# EAGLE design GW-RS485-V41-007 (EAGLE 9.1.0)
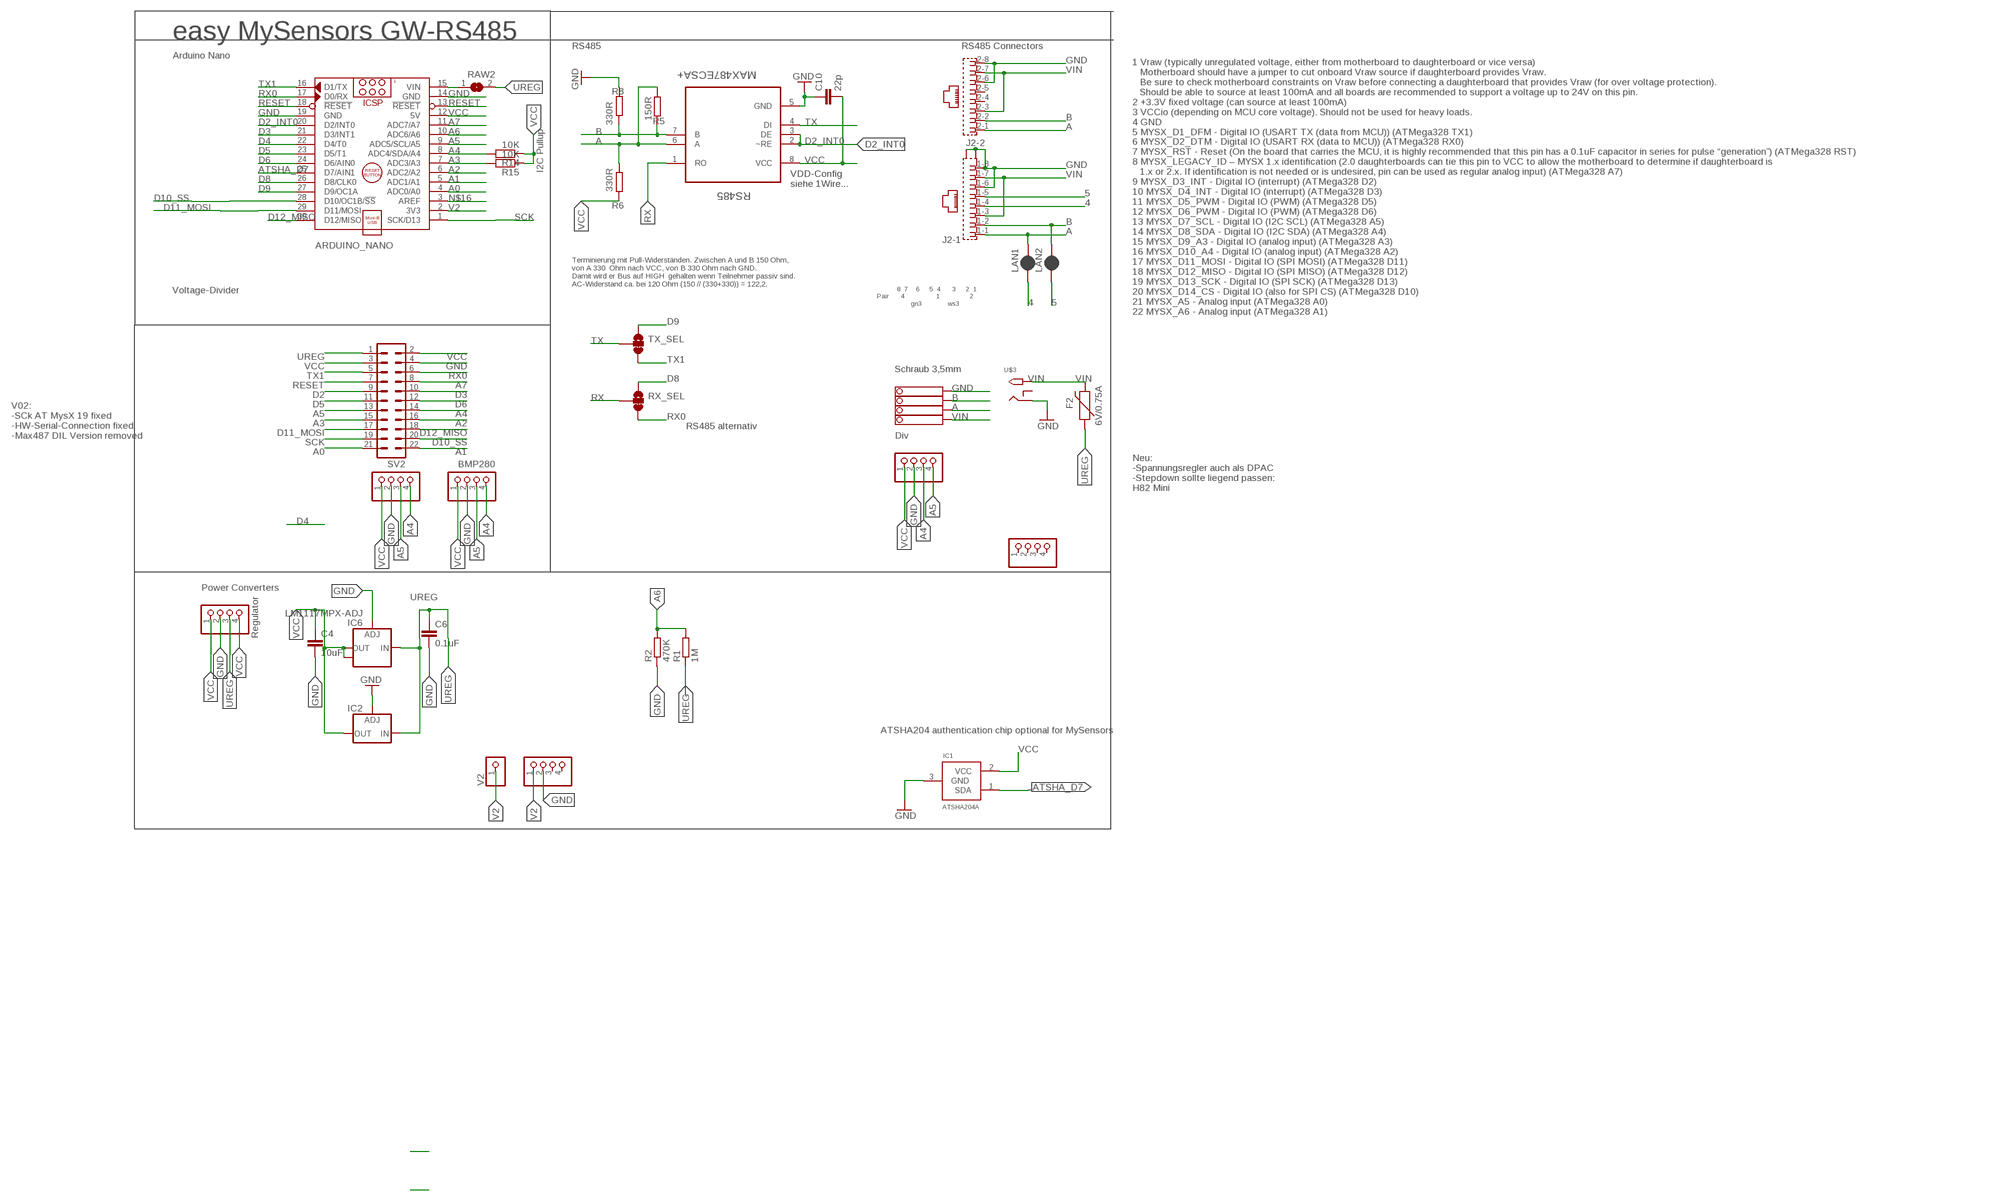
[diagram p0: schematic, sheet 1]

## Parts
ARDUINO_NANO  ARDUINO_NANO_OHNE-BOHR  [ARDUINO_NANO]
BH1750  PINHD-1X04_2.54-S  [1X04-S]
C4  10uF  C-EUC1210  [C1210]
C6  0.1uF  C-EUC1206  [C1206]
C10  22p  C-EUC0805  [C0805]
F2  6V/0.75A  PPTC_THREE-QUARTER-AMP  [1206]
I2C-1  PINHD-1X04_2.54-S  [1X04-S]
I2C-2  PINHD-1X04_2.54-S  [1X04-S]
IC1  ATSHA204A  [SOT23]
IC2  LD117ADT50TR  [DPACK]
IC6  LM1117MPX-ADJ  [SOT223]
J2  RJ45_2X_S  [RJ45_2X_S]
JP2  PINHD-1X04_2.54-S  [1X04-S]
LAN1  JUMPER-SMT_2_NC_PASTE_SILK  [SMT-JUMPER_2_NC_PASTE_SILK]
LAN2  JUMPER-SMT_2_NC_PASTE_SILK  [SMT-JUMPER_2_NC_PASTE_SILK]
R1  1M  R-EU_R0805  [R0805]
R2  470K  R-EU_R0805  [R0805]
R5  150R  R-EU_R0805  [R0805]
R6  330R  R-EU_R0805  [R0805]
R8  330R  R-EU_R0805  [R0805]
R14  10K  R-EU_R0805  [R0805]
R15  10K  R-EU_R0805  [R0805]
RAW2  SJ  [SJ]
RS485  MAX487ECSA+  [SOIC127P600X175-8N]
RX_SEL  JUMPER-SMT_3_1-NC_TRACE_SILK  [SMT-JUMPER_3_1-NC_TRACE_SILK]
STEPDWN  PINHD-1X04_2.54-S  [1X04-S]
SV2  MA11-2  [MA11-2]
TX_SEL  JUMPER-SMT_3_1-NC_TRACE_SILK  [SMT-JUMPER_3_1-NC_TRACE_SILK]
U$3  2.1MMJACKTHM  [PJ-102A]
V2  PINHD-1X1  [1X01]
V2-  PINHD-1X04_2.54-S  [1X04-S]
X4  1751264  [1751264]

## Nets
4: J2.1-4 LAN1.1
5: J2.1-5 LAN2.1
A: J2.1-1 J2.2-1 LAN1.2 R5.1 R6.2 RS485.6(A) X4.2
A0: ARDUINO_NANO.4(ADC0/A0) SV2.21
A1: ARDUINO_NANO.5(ADC1/A1) SV2.22
A2: ARDUINO_NANO.6(ADC2/A2) SV2.16
A3: ARDUINO_NANO.7(ADC3/A3) R15.2 SV2.15
A4: ARDUINO_NANO.8(ADC4/SDA/A4) BH1750.4 I2C-1.4 I2C-2.3 R14.2 SV2.14
A5: ARDUINO_NANO.9(ADC5/SCL/A5) BH1750.3 I2C-1.3 I2C-2.4 SV2.13
A6: ARDUINO_NANO.10(ADC6/A6) R1.2 R2.2
A7: ARDUINO_NANO.11(ADC7/A7) SV2.8
ATSHA_D7: ARDUINO_NANO.25(D7/AIN1) IC1.1(SDA)
B: J2.1-2 J2.2-2 LAN2.2 R5.2 R8.1 RS485.7(B) X4.3
D2: SV2.9
D2_INT0: ARDUINO_NANO.20(D2/INT0) RS485.2(~RE) RS485.3(DE)
D3: ARDUINO_NANO.21(D3/INT1) SV2.10
D4: ARDUINO_NANO.22(D4/T0)
D5: ARDUINO_NANO.23(D5/T1) SV2.11
D6: ARDUINO_NANO.24(D6/AIN0) SV2.12
D8: ARDUINO_NANO.26(D8/CLK0) RX_SEL.1
D9: ARDUINO_NANO.27(D9/OC1A) TX_SEL.1
D10_SS: ARDUINO_NANO.28(D10/OC1B/!SS) SV2.20
D11_MOSI: ARDUINO_NANO.29(D11/MOSI) SV2.17
D12_MISO: ARDUINO_NANO.30(D12/MISO) SV2.18
GND [Power]: ARDUINO_NANO.14(GND) ARDUINO_NANO.19(GND) BH1750.2 C4.2 C6.2 C10.1 I2C-1.2 I2C-2.2 IC1.3(GND) IC2.1(ADJ) IC6.1(ADJ) J2.1-6 J2.1-8 J2.2-6 J2.2-8 J2.G1(-1:S2) J2.G3(-1:S1) R2.1 R8.2 RS485.5(GND) STEPDWN.2 SV2.4 U$3.RING V2-.2 X4.4
N$16: ARDUINO_NANO.3(AREF)
RAW1 [Power]: ARDUINO_NANO.15(VIN) RAW2.1
RESET: ARDUINO_NANO.13(!RESET) ARDUINO_NANO.18(!RESET) SV2.7
RX: RS485.1(RO) RX_SEL.2
RX0: ARDUINO_NANO.17(D0/RX) RX_SEL.3 SV2.6
SCK: ARDUINO_NANO.1(SCK/D13) SV2.19
TX: RS485.4(DI) TX_SEL.2
TX1: ARDUINO_NANO.16(D1/TX) SV2.5 TX_SEL.3
UREG [Power]: C6.1 F2.1 IC2.3(IN) IC6.3(IN) R1.1 RAW2.2 STEPDWN.3 SV2.1
V2 [Power]: ARDUINO_NANO.2(3V3) V2-.1 V2.1
VCC [Power]: ARDUINO_NANO.12(5V) BH1750.1 C4.1 C10.2 I2C-1.1 I2C-2.1 IC1.2(VCC) IC2.4(OUT) IC6.2(OUT) IC6.TAB(OUT1) R6.1 R14.1 R15.1 RS485.8(VCC) STEPDWN.1 STEPDWN.4 SV2.2 SV2.3
VIN [Power]: F2.2 J2.1-3 J2.1-7 J2.2-3 J2.2-7 U$3.TIP X4.1
Unconnected: J2.2-4 J2.2-5 JP2.1 JP2.2 JP2.3 JP2.4 U$3.RING_SW V2-.3 V2-.4

## Notes on the sheet
- easy MySensors GW-RS485
- RS485 | RS485 Connectors
- Arduino Nano
- I2C Pullup
- VDD-Config
  siehe 1Wire...
- Voltage-Divider
- Terminierung mit Pull-Widerständen. Zwischen A und B 150 Ohm,
  von A 330  Ohm nach VCC, von B 330 Ohm nach GND. 
  Damit wird er Bus auf HIGH  gehalten wenn Teilnehmer passiv sind.
  AC-Widerstand ca. bei 120 Ohm (150 // (330+330)) = 122,2.
- 8  7    6     5  4      3     2  1
  Pair      4                1               2
                   gn3             ws3
- 1 Vraw (typically unregulated voltage, either from motherboard to daughterboard or vice versa)
     Motherboard should have a jumper to cut onboard Vraw source if daughterboard provides Vraw. 
     Be sure to check motherboard constraints on Vraw before connecting a daughterboard that provides Vraw (for over voltage protection). 
     Should be able to source at least 100mA and all boards are recommended to support a voltage up to 24V on this pin.
  2 +3.3V fixed voltage (can source at least 100mA)
  3 VCCio (depending on MCU core voltage). Should not be used for heavy loads.
  4 GND
  5 MYSX_D1_DFM - Digital IO (USART TX (data from MCU)) (ATMega328 TX1)
  6 MYSX_D2_DTM - Digital IO (USART RX (data to MCU)) (ATMega328 RX0)
  7 MYSX_RST - Reset (On the board that carries the MCU, it is highly recommended that this pin has a 0.1uF capacitor in series for pulse “generation”) (ATMega328 RST)
  8 MYSX_LEGACY_ID – MYSX 1.x identification (2.0 daughterboards can tie this pin to VCC to allow the motherboard to determine if daughterboard is 
     1.x or 2.x. If identification is not needed or is undesired, pin can be used as regular analog input) (ATMega328 A7)
  9 MYSX_D3_INT - Digital IO (interrupt) (ATMega328 D2)
  10 MYSX_D4_INT - Digital IO (interrupt) (ATMega328 D3)
  11 MYSX_D5_PWM - Digital IO (PWM) (ATMega328 D5)
  12 MYSX_D6_PWM - Digital IO (PWM) (ATMega328 D6)
  13 MYSX_D7_SCL - Digital IO (I2C SCL) (ATMega328 A5)
  14 MYSX_D8_SDA - Digital IO (I2C SDA) (ATMega328 A4)
  15 MYSX_D9_A3 - Digital IO (analog input) (ATMega328 A3)
  16 MYSX_D10_A4 - Digital IO (analog input) (ATMega328 A2)
  17 MYSX_D11_MOSI - Digital IO (SPI MOSI) (ATMega328 D11)
  18 MYSX_D12_MISO - Digital IO (SPI MISO) (ATMega328 D12)
  19 MYSX_D13_SCK - Digital IO (SPI SCK) (ATMega328 D13)
  20 MYSX_D14_CS - Digital IO (also for SPI CS) (ATMega328 D10)
  21 MYSX_A5 - Analog input (ATMega328 A0)
  22 MYSX_A6 - Analog input (ATMega328 A1)
- Schraub 3,5mm
- RS485 alternativ
- V02: 
  -SCk AT MysX 19 fixed
  -HW-Serial-Connection fixed
  -Max487 DIL Version removed
- Div
- BMP280
- Neu:
  -Spannungsregler auch als DPAC
  -Stepdown sollte liegend passen:  
  H82 Mini
- Power Converters
- Regulator
- ATSHA204 authentication chip optional for MySensors

## Library data of the parts
ARDUINO_NANO = ArduinoNanoV30:ARDUINO_NANO_OHNE-BOHR: Arduino Nano V3.0 Module Overview: The Arduino Nano is a small, complete, and breadboard-friendly board based on the ATmega328 (Arduino Nano 3.x) or ATmega168 (Arduino Nano 2.x). It has more or less the same functionality of the Arduino Duemilanove, but in a different package. It lacks only a DC power jack, and works with a Mini-B USB cable instead of a standard one. The Nano was designed and is being produced by Gravitech <http://www.gravitech.us/arna30wiatp.html>. General specifications: Item Value Microcontroller Atmel ATmega168 or ATmega328 Operating Voltage (logic level) 5 V Input Voltage (recommended) 7-12 V Input Voltage (limits) 6-20 V Digital I/O Pins 14 (of which 6 provide PWM output) Analog Input Pins 8 DC Current per I/O Pin 40 mA Flash Memory 16 KB (ATmega168) or 32 KB (ATmega328) of which 2 KB used by bootloader SRAM 1 KB (ATmega168) or 2 KB (ATmega328) EEPROM 512 bytes (ATmega168) or 1 KB (ATmega328) Clock Speed 16 MHz Dimensions (Inches) 0.73" x 1.70" Dimensions (mm) 18mm x 45mm Overall height About 9 mm (not including pins) Weigth 5 g Power: The Arduino Nano can be powered via the Mini-B USB connection, 6-20V unregulated external power supply (pin 30), or 5V regulated external power supply (pin 27). The power source is automatically selected to the highest voltage source. Memory: The ATmega168 has 16 KB of flash memory for storing code (of which 2 KB is used for the bootloader); the ATmega328 has 32 KB, (also with 2 KB used for the bootloader). The ATmega168 has 1 KB of SRAM and 512 bytes of EEPROM (which can be read and written with the EEPROM library); the ATmega328 has 2 KB of SRAM and 1 KB of EEPROM. Input and Output: Each of the 14 digital pins on the Nano can be used as an input or output, using pinMode(), digitalWrite(), and digitalRead() functions. They operate at 5 volts. Each pin can provide or receive a maximum of 40 mA and has an internal pull-up resistor (disconnected by default) of 20-50 kOhms. In addition, some pins have specialized functions. Visit Arduino - ArduinoBoardNano <https://www.arduino.cc/en/Main/ArduinoBoardNano>
BH1750 I2C-1 I2C-2 JP2 STEPDWN V2- = pinhead-2:PINHD-1X04: PIN HEADER
C4 C6 C10 = rcl:C-EU: CAPACITOR, European symbol
F2 = SparkFun-Fuses:PPTC: Resettable Fuse PPTC Resettable Fuse. Really a sort of resistor with a polymeric positive temperature coefficient whose resistance increases dramatically with an increase in temperature. When heated by the power passing through the resistance rises causing the current to be limited, protecting the circuit. This is achieved by the transition of the polymer from a crystalline to an amorphous state where the conductive carbon separates breaking the conductive pathways found in the cool crystalline structure. When a PPTC cools back down it resumes conducting letting the circuit turn back on. SparkFun Products: SparkFun RedBoard - Programmed with Arduino <https://www.sparkfun.com/products/12757> Pro Micro - 5V/16MHz <https://www.sparkfun.com/products/12640> Arduino Pro 328 - 5V/16MHz <https://www.sparkfun.com/products/10915> MP3 Trigger <https://www.sparkfun.com/products/13720>; PROD_ID: RES-11150
IC1 = Sensor:ATSHA204A
IC2 = v-reg:LD117A?*: Low drop fixed and adjustable positive voltage regulators 1 A Source: http://www.st.com/stonline/products/literature/ds/7194/ld1117axx.pdf
IC6 = lm1117:LM1117MPX-ADJ
J2 = RJ45:RJ45_2X_S: AMP connector
LAN1 LAN2 = SparkFun-Jumpers:JUMPER-SMT_2_NC_PASTE: Normally closed solder jumper This jumper has an aperture in the stencil to allow solder paste to bridge the split in the wire so it's normally closed (NC). Wick off the solder to open the connection. Reapply solder to reclose the connection.
R1 R2 R5 R6 R8 R14 R15 = rcl:R-EU_: RESISTOR, European symbol
RAW2 = jumper:SJ: SMD solder JUMPER
RS485 = Maxim_By_element14_Batch_1:MAX487ECSA+: Low-Power, Slew-Rate-Limited RS-485/RS-422 Transceivers; MPN: MAX487ECSA+; OC_FARNELL: 9724532; OC_NEWARK: 68K4803; PACKAGE: SOIC-8; SUPPLIER: Maxim
RX_SEL TX_SEL = SparkFun-Jumpers:JUMPER-SMT_3_1-NC_TRACE: Normally closed trace jumper (1 of 2 connections) This jumper has a trace between two pads so it's normally closed (NC). The other connection is normally open (NO). Use a razor knife to open the connection. For best results follow the IPC guidelines for cutting traces: Cutout at least 0.063 mm (0.005 in). Remove all loose material to clean up the cut area. Seal the cut with an approved epoxy. Reapply solder to reclose the connection, or to close the NO connection.
SV2 = con-Pinheader:MA11-2: PIN HEADER; OC_FARNELL: unknown; OC_NEWARK: unknown
U$3 = adafruit:2.1MMJACK: 2.1mm x 5.5mm THM DC jack with internal switch. Digikey part #PJ-102A, 4UCON part #05537 2.1mm x 5.5mm SMT DC jack with internal switch. Digikey part #PJ-002A-SMT, 4UCON part #03267 By microbuilder.eu & adafruit.com
V2 = pinhead:PINHD-1X1: PIN HEADER
X4 = con-phoenix-350:1751264: MKDS 1/ 4-3,5 Printklemme Nennstrom: 10 A Bemessungsspannung: 160 V Raster: 3,5 mm Polzahl: 4 Montageart: Löten Anschlussart: Schraubanschluss Anschlussrichtung vom Leiter zur Platine: 0° Source: http://eshop.phoenixcontact.com .. 1751264.pdf; MPN: 1751264; OC_FARNELL: unknown; OC_NEWARK: 10R0934

## Net classes
0 default: width 0.305 mm
1 Power: width 0.508 mm

## Board
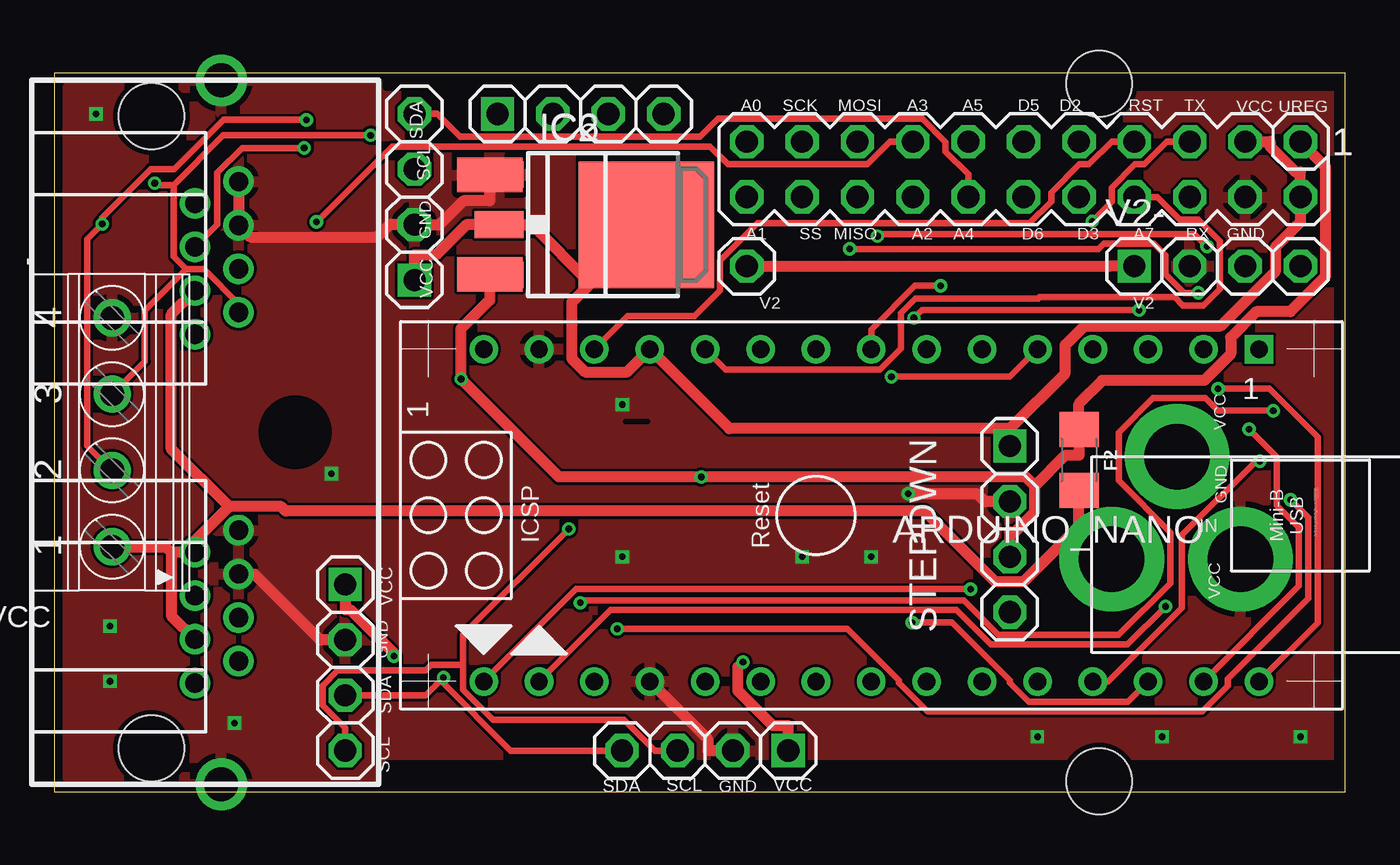
[diagram p1: board, top side]
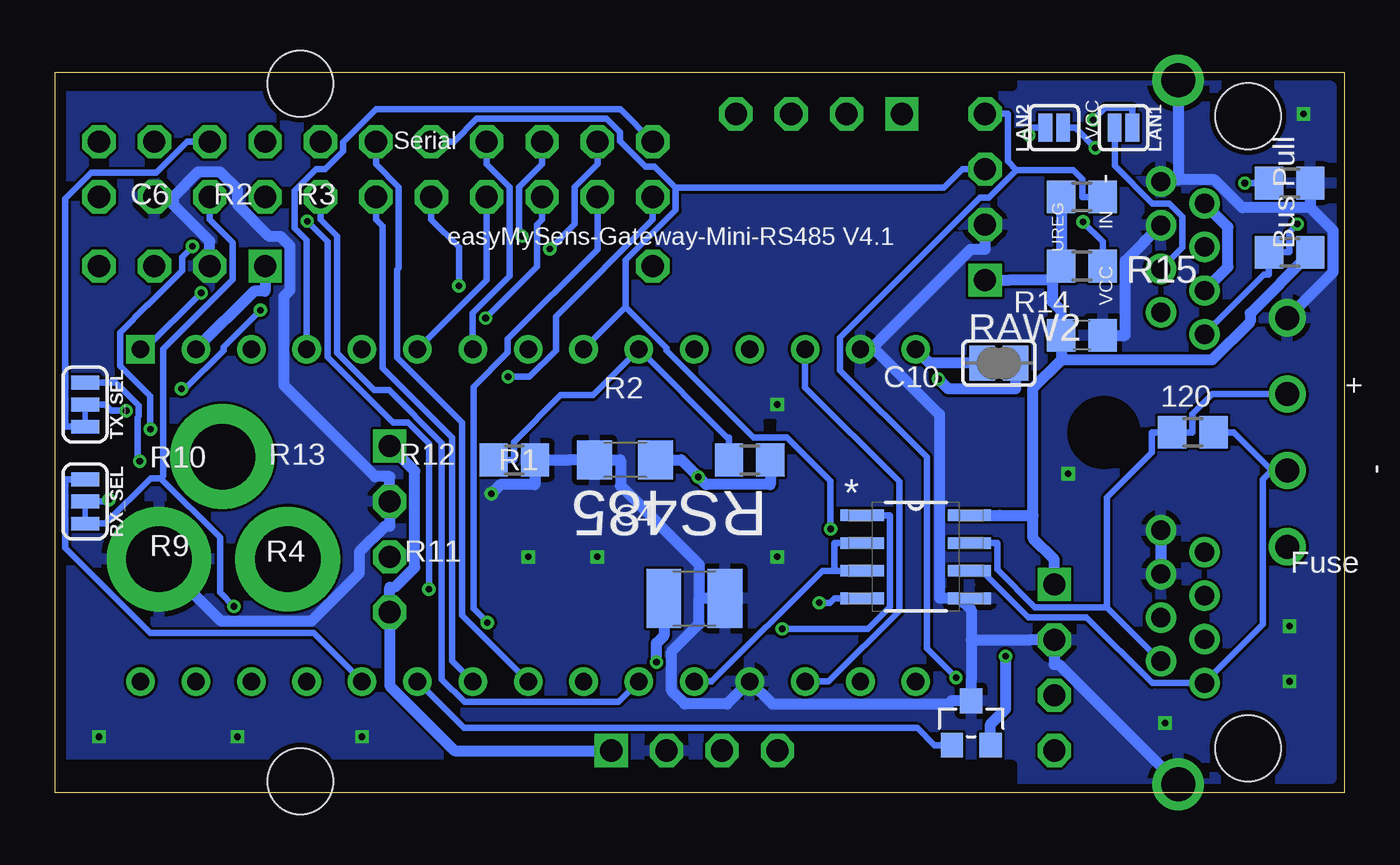
[diagram p2: board, bottom side, seen from below]

Size 59.19 x 33 mm. Coordinates in mm from the lower left corner, seen from the top.
Outline: 59.19,0 0,0 0,33 59.19,33 59.19,0
Copper layers (1*16): Top 0.035mm / dielectric 1.5mm / Bottom 0.035mm
Design rules "dirt_cheap_dirty_boards.v1": minimum track width 5mil, minimum drill 12mil, track to track 5mil, track to pad 5mil, pad to pad 5mil, via to via 5mil, smd to smd 0mil, copper to edge 10mil, drill to drill 10mil, minimum pad ring 10mil, minimum via ring 6mil, stop-mask expansion 2mil, vias tented up to drill 25mil, thermal gap 10mil
Holes 3 mm at 47.91,32.5 47.91,0.5
tRestrict: area 15.2,32.4 to 59.1,33; area 15.2,0 to 59.1,1.3; area 9.4,14.9 to 12.6,18.1; 1 lines
bRestrict: area 15.2,32.4 to 59.1,33; area 15.2,0 to 59.1,1.3; area 9.5,14.9 to 12.7,18.1; 1 lines

### Footprints (pad centres in the part's own frame; a part is rotated, then mirrored left to right if it is on the bottom)
ARDUINO_NANO = drill 0.8 square: 1 -20.32,-7.62 | drill 0.8: 2 -17.78,-7.62; 3 -15.24,-7.62; 4 -12.7,-7.62; 5 -10.16,-7.62; 6 -7.62,-7.62; 7 -5.08,-7.62; 8 -2.54,-7.62; 9 0,-7.62; 10 2.54,-7.62; 11 5.08,-7.62; 12 7.62,-7.62; 13 10.16,-7.62; 14 12.7,-7.62; 15 15.24,-7.62; 16 15.24,7.62; 17 12.7,7.62; 18 10.16,7.62; 19 7.62,7.62; 20 5.08,7.62; 21 2.54,7.62; 22 0,7.62; 23 -2.54,7.62; 24 -5.08,7.62; 25 -7.62,7.62; 26 -10.16,7.62; 27 -12.7,7.62; 28 -15.24,7.62; 29 -17.78,7.62; 30 -20.32,7.62
1X04-S = drill 1.016 square: 1 -3.81,0 | drill 1.016 octagon: 2 -1.27,0; 3 1.27,0; 4 3.81,0
C1210 = smd 1.6 x 2.7: 1 -1.4,0; 2 1.4,0
C1206 = smd 1.6 x 1.8: 1 -1.4,0; 2 1.4,0
C0805 = smd 1.3 x 1.5: 1 -0.95,0; 2 0.95,0
1206 = smd 1.6 x 1.8: 1 -1.4,0; 2 1.4,0
SOT23 = smd 1.016 x 1.143: 1 -0.889,-1.016; 2 0.889,-1.016; 3 0,1.016
DPACK = smd 1.6 x 3: 1 -2.28,-4.8; 3 2.28,-4.8 | smd 5.8 x 6.2: 4 0,2.38
SOT223 = smd 1.219 x 2.235: 1 -2.311,-3.099; 2 0,-3.099; 3 2.311,-3.099 | smd 3.6 x 2.2: TAB 0,3.099
RJ45_2X_S = drill 0.889: 1-1 -4.5,2; 1-2 -5.5,4; 1-3 -6.5,2; 1-4 -7.5,4; 1-5 -8.5,2; 1-6 -9.5,4; 1-7 -10.5,2; 1-8 -11.5,4; 2-1 11.5,2; 2-2 10.5,4; 2-3 9.5,2; 2-4 8.5,4; 2-5 7.5,2; 2-6 6.5,4; 2-7 5.5,2; 2-8 4.5,4 | drill 1.575 pad 2.184: G1 -16.15,3.2; G3 16.15,3.2 | hole 3: -14.5,0; 14.5,0
SMT-JUMPER_2_NC_PASTE_SILK = smd 0.635 x 1.27: 1 -0.406,0; 2 0.406,0
R0805 = smd 1.3 x 1.5: 1 -0.95,0; 2 0.95,0
SJ = smd 1.168 x 1.6: 1 -0.762,0; 2 0.762,0
SOIC127P600X175-8N = smd 1.981 x 0.533: 1 -2.464,1.905; 2 -2.464,0.635; 3 -2.464,-0.635; 4 -2.464,-1.905; 5 2.464,-1.905; 6 2.464,-0.635; 7 2.464,0.635; 8 2.464,1.905
SMT-JUMPER_3_1-NC_TRACE_SILK = smd 0.635 x 1.27: 1 -1.016,0; 2 0,0; 3 1.016,0
MA11-2 = drill 1.016 octagon: 1 -12.7,-1.27; 2 -12.7,1.27; 3 -10.16,-1.27; 4 -10.16,1.27; 5 -7.62,-1.27; 6 -7.62,1.27; 7 -5.08,-1.27; 8 -5.08,1.27; 9 -2.54,-1.27; 10 -2.54,1.27; 11 0,-1.27; 12 0,1.27; 13 2.54,-1.27; 14 2.54,1.27; 15 5.08,-1.27; 16 5.08,1.27; 17 7.62,-1.27; 18 7.62,1.27; 19 10.16,-1.27; 20 10.16,1.27; 21 12.7,-1.27; 22 12.7,1.27
PJ-102A = drill 3 pad 4.8: RING 0.1,-3.39; RING_SW -4.6,-6.29; TIP 0.1,-9.29
1X01 = drill 1.016 octagon: 1 0,0
1751264 = drill 1.1 pad 1.7: 1 -5.25,-0.1; 2 -1.75,-0.1; 3 1.75,-0.1; 4 5.25,-0.1

### Placement (x,y rotation side)
ARDUINO_NANO  34.92,12.7 180 top
BH1750  16.51,27.3 90 top
C4  29.85,8.89 0 bottom
C6  33.02,15.24 180 bottom
C10  12.06,20.95 180 bottom
F2  46.99,15.24 270 top
I2C-1  29.85,1.91 180 top
I2C-2  13.33,5.71 270 top
IC1  17.14,3.17 0 bottom
IC2  24.77,26.04 270 top
IC6  23.5,26.04 270 top
J2  4.45,16.51 270 top
JP2  24.13,31.11 0 top
LAN1  10.16,30.48 0 bottom
LAN2  13.33,30.48 180 bottom
R1  27.3,15.24 180 bottom
R2  38.1,15.24 180 bottom
R5  6.98,16.51 180 bottom
R6  2.54,24.77 180 bottom
R8  2.54,27.94 0 bottom
R14  12.06,27.3 0 bottom
R15  12.06,24.13 0 bottom
RAW2  15.87,19.68 0 bottom
RS485  19.69,10.79 0 bottom
RX_SEL  57.78,13.34 270 bottom
STEPDWN  43.81,12.06 270 top
SV2  44.45,28.57 180 top
TX_SEL  57.78,17.78 270 bottom
U$3  57.78,10.79 270 top
V2  31.75,24.13 0 top
V2-  53.34,24.13 0 top
X4  2.54,16.51 90 top

### Tracks (layer width: path | path; a pad name or v marks a point on that pad's centre or on a via)
4
  Bottom 0.305: LAN1.1 10.57,28.75 8.83,27.01 8.06,27.01 7.46,26.41 7.46,24.99 J2.1-4
5  (via drill 0.3 pad 0.61)
  Top 0.305: v11.45,29.55 8.6,29.55 7.47,28.42 7.47,26.03 J2.1-5
  Bottom 0.305: v11.45,29.55 12.33,30.44 12.33,30.48 LAN2.1
A  (via drill 0.3 pad 0.61)
  Top 0.305: v11.55,30.84 7.76,30.84 5.5,28.58 4.41,28.58 2.19,26.36 v2.19,26.06 1.51,25.38 1.51,15.89 X4.2
  Bottom 0.305: RS485.6 16.65,10.16 14.52,8.03 11.85,8.03 8.84,5.01 J2.2-1 3.77,7.69 3.77,14.35 3.36,14.76 | 3.36,14.76 5.11,16.51 R5.1 | X4.2 3.36,14.76 | v11.55,30.84 11,31.39 9.75,31.39 LAN1.2 | v2.19,26.06 2.56,25.69 2.56,24.77 R6.2 3.49,23.74 3.72,23.74 J2.1-1
A0
  Bottom 0.305: SV2.21 33.23,31.33 44.44,31.33 45.95,29.82 45.95,29.41 46.79,28.57 47.2,28.57 48.18,27.59 48.18,25.87 47.62,25.32 ARDUINO_NANO.4
A1  (via drill 0.3 pad 0.61)
  Top 0.305: ARDUINO_NANO.5 43.82,19.06 v38.39,19.06
  Bottom 0.305: SV2.22 31.75,26.26 36.2,21.82 36.2,20.27 37.41,19.06 v38.39,19.06
A2
  Bottom 0.305: SV2.16 39.37,23.5 ARDUINO_NANO.6
A3  (via drill 0.3 pad 0.61)
  Top 0.305: SV2.15 38.33,29.84 37.28,28.8 30.88,28.8 30.07,29.62 15.47,29.62 v12.01,26.16
  Bottom 0.305: v12.01,26.16 11.12,25.26 R15.2 | ARDUINO_NANO.7 40.01,21.98 38.33,23.67 38.33,27.76 39.37,28.8 SV2.15
A4  (via drill 0.3 pad 0.61)
  Top 0.305: BH1750.4 17.55,31.11 18.59,30.07 29.62,30.07 30.43,30.89 39.81,30.89 40.87,29.83 40.87,29.39 41.91,28.35 SV2.14 | ARDUINO_NANO.8 37.46,21.23 39.47,23.23 v40.64,23.23 | 17.71,5.12 20.93,1.91 24.99,1.91 I2C-1.4 | 17.71,5.12 17.03,4.45 13.96,4.45 I2C-2.3 | 17.71,5.12 v17.84,5.26
  Bottom 0.305: 15.07,28.54 16.33,27.28 16.74,27.28 23.16,20.86 23.16,19.35 19.18,15.37 19.18,6.6 v17.84,5.26 | SV2.14 41.91,26.26 40.64,25 v40.64,23.23 | 15.07,28.54 12.45,28.54 12.04,28.13 12.04,27.3 R14.2 | 15.07,28.54 15.47,28.94 15.47,31.11 BH1750.4
A5  (via drill 0.3 pad 0.61)
  Top 0.305: 18.75,5.84 18.75,7.24 v23.59,12.08 | 18.75,5.84 17.28,5.84 17.02,5.58 13,5.58 12.29,4.88 12.29,3.99 13.33,2.95 I2C-2.4 | 18.75,5.84 18.75,4.69 20.12,3.32 26.12,3.32 27.53,1.91 I2C-1.3
  Bottom 0.305: 32.99,22.25 32.99,24.41 30.71,26.7 30.71,27.73 | v23.59,12.08 23.59,14.27 25.6,16.28 27.13,16.28 31.11,20.26 31.11,20.38 32.99,22.25 | 32.99,22.25 ARDUINO_NANO.9 | 30.71,27.73 31.67,28.7 32.07,28.7 33.25,29.87 33.25,30.28 33.86,30.89 39.82,30.89 40.87,29.84 SV2.13 | 30.71,27.73 18.39,27.73 17.55,28.57 BH1750.3
A6
  Bottom 0.305: R1.2 28.25,16.27 28.33,16.27 ARDUINO_NANO.10 34.49,18.21 35.98,18.21 38.12,16.07 38.12,15.24 R2.2
A7
  Top 0.305: SV2.8 50.57,27.3 51.61,26.26 52.46,26.26 53.45,25.27 53.45,23.07 52.7,22.32 51.76,22.32 51.38,22.7 45.17,22.7 45.12,22.65 39.5,22.65 38.83,21.98 38.83,20.36 37.86,19.38 30.78,19.38 ARDUINO_NANO.11
ATSHA_D7
  Bottom 0.305: IC1.1 18.82,2.16 19.61,2.95 40.41,2.95 ARDUINO_NANO.25
B  (via drill 0.3 pad 0.61)
  Top 0.305: 5.47,27.86 7.74,30.14 v14.5,30.14 | v4.59,27.94 4.67,27.86 5.47,27.86 | 5.47,27.86 5.47,24.56 6.04,23.99 | 6.04,23.99 6.85,23.99 8.45,22.4 J2.1-2 | X4.3 4.15,19.77 4.15,22.1 6.04,23.99
  Bottom 0.305: v14.5,30.14 14.5,30.32 14.34,30.48 LAN2.2 | 10.91,8.48 J2.2-2 | 10.91,8.48 14.21,8.48 15.95,10.22 15.95,11.43 RS485.7 | 10.91,8.48 10.91,13.53 8.86,15.58 8.86,16.51 R5.2 7.01,16.51 7.01,17.34 6.08,18.26 X4.3 | R8.1 v4.59,27.94
D2_INT0
  Bottom 0.305: 23.42,10.16 23.97,10.16 29.05,5.08 ARDUINO_NANO.20 | 23.42,10.16 23.42,11.43 RS485.2 | RS485.3 23.42,10.16
D3
  Bottom 0.305: ARDUINO_NANO.21 33.32,4.14 40.39,4.14 41.43,5.18 41.43,16.02 43.85,18.45 44.53,18.45 46.23,20.14 46.23,25.5 46.99,26.26 SV2.10
D5
  Bottom 0.305: SV2.11 44.45,28.8 43.41,27.76 43.41,24.04 43.49,23.96 43.49,19.94 40.5,16.95 40.5,8.12 ARDUINO_NANO.23
D6
  Bottom 0.305: ARDUINO_NANO.24 40.96,6.03 40.96,16.27 44.15,19.47 44.15,25.96 44.45,26.26 SV2.12
D8
  Bottom 0.305: ARDUINO_NANO.26 47.31,7.31 54.8,7.31 58.7,11.21 58.7,14.35 RX_SEL.1
D9  (via drill 0.3 pad 0.61)
  Top 0.305: ARDUINO_NANO.27 48.35,5.08 51.72,8.45 51.72,11.8 55.09,15.18 v55.28,15.18
  Bottom 0.305: v55.28,15.18 55.38,15.28 55.38,17.2 55.32,17.26 55.32,17.74 56.38,18.8 56.87,18.8 TX_SEL.1
D10_SS  (via drill 0.3 pad 0.61)
  Top 0.305: v39.33,7.78 41.17,7.78 43.81,5.13 43.81,5.03 44.7,4.14 49.23,4.14 ARDUINO_NANO.28
  Bottom 0.305: SV2.20 34.29,24.89 38.4,20.78 38.4,20.17 39.98,18.59 39.98,8.43 v39.33,7.78
D11_MOSI  (via drill 0.3 pad 0.61)
  Top 0.305: v37.74,25.51 37.84,25.6 52.29,25.6 v52.86,25.03 | v54.8,16.64 56.05,15.39 56.05,13.16 57.08,12.14 57.08,9.45 ARDUINO_NANO.29
  Bottom 0.305: v54.8,16.64 54.8,18.17 56.18,19.55 56.18,21.09 54.91,22.36 54.9,22.36 53.34,23.92 53.34,24.55 v52.86,25.03 | v37.74,25.51 37.88,25.64 37.88,27.76 36.83,28.8 SV2.17
D12_MISO  (via drill 0.3 pad 0.61)
  Top 0.305: ARDUINO_NANO.30 57.94,7.78 57.94,16.29 55.72,18.51 v53.36,18.51 | v49.74,22.11 39.79,22.11 v39.42,21.75
  Bottom 0.305: v39.42,21.75 37.05,24.12 37.05,26.04 36.83,26.26 SV2.18 | v53.36,18.51 53.19,18.51 51.43,20.27 51.43,20.42 v49.74,22.11
GND  (via drill 0.3 pad 0.61)
  Top 0.508: I2C-1.2 29.97,1.91 29.97,2.41 ARDUINO_NANO.19 | STEPDWN.2 42.67,13.34 42.31,13.7 v39.15,13.7 | J2.1-8 J2.1-6 8.98,25.47 14.8,25.47 15.37,26.04 BH1750.2 17.65,26.04 18.75,27.13 19.96,27.13 IC2.1 20,28.35 IC6.1 | I2C-2.2 12.19,6.99 9.17,10.01 J2.2-6
  Bottom 0.508: 29.63,8.89 29.63,7.71 30.88,6.45 30.88,4.65 30.28,4.04 28.34,4.04 ARDUINO_NANO.19 26.27,4.04 18.18,4.04 18.03,4.19 IC1.3 17.14,5.14 17.14,6.99 | 17.68,8.89 17.14,8.35 17.14,6.99 | 17.14,6.99 14.48,6.99 I2C-2.2 13.33,5.84 13.11,5.84 7.64,0.38 J2.G3 | 17.68,8.89 18.59,8.89 18.59,17.33 21.58,20.32 | RS485.5 17.68,8.89 | 53.76,27.3 53.76,26.96 52.07,25.27 V2-.2 | 53.76,27.3 52.61,28.45 51.59,28.45 50.8,27.65 50.8,26.96 49.34,25.49 48.82,25.49 48.39,25.06 48.39,23.03 48.66,22.75 48.66,18.66 44.49,14.48 43.81,14.48 STEPDWN.2 43.81,12.19 44.04,12.19 45.21,11.02 45.21,10.04 47.41,7.84 51.54,7.84 U$3.RING | 53.76,27.3 54.04,27.3 SV2.4 | 29.63,8.89 29.63,10.45 33.24,14.06 33.24,15.24 C6.2 35.01,15.24 35.6,15.24 R2.1 37.15,14.11 38.74,14.11 v39.15,13.7 | C4.2 29.63,8.89 | 7.64,28.09 8.37,28.09 J2.1-8 | 1.59,26.81 4.71,26.81 5.99,28.09 7.64,28.09 | J2.G1 7.64,28.09 | 1.59,26.81 0.56,25.78 0.56,23.84 X4.4 | 21.58,20.32 ARDUINO_NANO.14 | 21.58,20.32 21.58,20.49 17.18,24.89 16.51,24.89 BH1750.2 | R8.2 1.59,26.81 | C10.1 10.08,20.95 10.08,24.37 J2.1-6 | J2.2-8 J2.2-6
  other vias: 2.54,5.08 2.54,7.62 1.9,31.11 12.7,14.61 8.25,3.17 26.04,17.78 37.46,10.79 34.29,10.79 26.04,10.79 45.09,2.54 57.15,2.54 50.8,2.54
  pour Bottom: 0.64,32.38 58.42,32.38 58.42,0.64 0.64,0.64
  pour Top: 0.64,32.38 58.42,32.38 58.42,0.64 0.64,0.64
RAW1
  Bottom 0.508: RAW2.1 19.05,19.68 ARDUINO_NANO.15
RESET
  Top 0.305: SV2.7 48.49,29.84 47.45,28.8 47.01,28.8 45.72,27.51 45.72,27.1 44.71,26.09 32.24,26.09 30.52,24.38 30.52,23.02 29.35,21.84 26.29,21.84 ARDUINO_NANO.13
  Bottom 0.305: ARDUINO_NANO.18 | ARDUINO_NANO.18 23.69,5.08 20.45,8.32 20.45,14.25 24.77,18.57 ARDUINO_NANO.13
RX  (via drill 0.3 pad 0.61)
  Top 0.305: v25.81,7.49 36.38,7.49 38.73,5.13 38.73,5.02 40.05,3.71 52.66,3.71 53.82,4.88 53.82,5.19 57.51,8.88 57.51,12.6 v56.7,13.41
  Bottom 0.305: RS485.1 20.88,12.7 20.88,8.5 21.89,7.49 v25.81,7.49 | RX_SEL.2 56.77,13.34 v56.7,13.41
RX0  (via drill 0.3 pad 0.61)
  Top 0.305: v50.96,8.53 49.22,6.78 42.95,6.78 41.37,8.36 25.51,8.36 ARDUINO_NANO.17
  Bottom 0.305: 54.31,14.4 54.21,14.5 54.21,20.33 51.03,23.51 51.03,25.22 52.07,26.26 SV2.6 | 54.31,14.4 54.79,14.4 56.87,12.32 RX_SEL.3 | 54.31,14.4 51.6,11.69 51.6,9.16 v50.96,8.53
SCK  (via drill 0.3 pad 0.61)
  Top 0.305: v52.46,22.91 51.82,22.91 50.95,23.77 50.95,24.63 50.41,25.17 48.14,25.17 47.89,24.92 v36.47,24.92
  Bottom 0.305: v36.47,24.92 35.33,26.06 35.33,27.76 34.29,28.8 SV2.19 | v52.46,22.91 55.04,20.32 ARDUINO_NANO.1
TX  (via drill 0.3 pad 0.61)
  Top 0.305: v55.91,17.5 53.35,17.5 52.78,18.07 50.38,18.07 48.81,16.5 48.81,14.29 51.18,11.92 51.18,9.59 48.8,7.21 43.3,7.21 41.71,8.79 24.23,8.79 v24.12,8.69
  Bottom 0.305: v24.12,8.69 23.62,8.69 23.42,8.89 RS485.4 | TX_SEL.2 56.87,17.78 56.59,17.5 v55.91,17.5
TX1  (via drill 0.3 pad 0.61)
  Top 0.305: ARDUINO_NANO.16 23.92,9.32 v42.02,9.32 | v47.6,26.19 48.49,27.08 48.49,27.74 49.55,28.8 49.99,28.8 51.03,29.84 SV2.5
  Bottom 0.305: v42.02,9.32 42.02,16 42.98,16.96 43.66,16.96 46.66,19.96 46.66,25.26 v47.6,26.19 | SV2.5 53.11,29.84 54.53,28.42 57.51,28.42 58.7,27.23 58.7,16.76 TX_SEL.3
UREG  (via drill 0.3 pad 0.61)
  Top 0.508: SV2.1 58.3,28.7 58.3,23.65 56.68,22.04 55.12,22.04 53.94,20.87 53.94,20.09 52.74,18.89 48.06,18.89 46.99,17.82 F2.1 46.99,15.46 46.36,15.46 44.96,14.05 | IC6.3 20,23.72 IC2.3 19.96,22.57 18.65,21.26 v18.65,18.95 23.14,14.46 v29.66,14.46 29.68,14.48 44.53,14.48 44.96,14.05 | 44.96,14.05 44.96,12.86 44.04,11.94 43.81,11.94 STEPDWN.3
  Bottom 0.508: R1.1 26.36,14.11 29.31,14.11 v29.66,14.46 30.44,15.24 C6.1 | v18.65,18.95 18.2,18.5 15.11,18.5 RAW2.2
V2
  Top 0.508: V2.1 32.89,24.13 48.39,24.13 V2-.1
  Bottom 0.508: V2-.1 49.53,22.99 50.04,22.99 ARDUINO_NANO.2
VCC  (via drill 0.3 pad 0.61)
  Top 0.508: I2C-2.1 13.33,8.38 13.56,8.38 15.57,6.37 v15.57,6.23 | I2C-1.1 33.66,3.05 32.95,3.05 31.35,4.65 31.35,5.73 v31.58,5.96 | SV2.3 55.75,29.84 55.75,29.62 56.93,28.45 57.15,28.45 SV2.2 57.15,26.16 56.01,25.02 56.01,23.91 53.49,21.39 47.23,21.39 46.35,20.52 46.35,19.21 43.81,16.67 | 43.81,16.67 30.95,16.67 ARDUINO_NANO.12 26.27,19.28 24.34,19.28 23.73,19.89 23.73,22.47 24.59,23.34 | STEPDWN.1 43.81,16.67 | 24.59,23.34 25.11,23.85 26.59,23.85 IC6.TAB IC2.4 | 24.59,23.34 21.89,26.04 IC6.2 18.9,26.04 17.5,24.64 16.51,24.64 BH1750.1
  Bottom 0.508: IC1.2 16.26,3.11 15.57,3.8 v15.57,6.23 | C4.1 31.25,7.16 31.58,6.83 v31.58,5.96 | I2C-1.1 40.84,1.91 43.81,4.88 STEPDWN.4 43.81,9.4 43.59,9.4 42.67,10.32 42.67,14.73 STEPDWN.1 | 13.43,23.5 13.43,23.72 R15.1 13.01,26.17 R14.1 | 13.43,23.5 13.43,22.5 13.01,22.09 C10.2 13.01,20.75 13.01,19.82 | 13.43,23.5 15.37,23.5 BH1750.1 | 14.31,12.7 14.31,18.53 13.01,19.82 | 14.31,12.7 14.31,11.64 13.33,10.67 I2C-2.1 | 14.31,12.7 15.85,12.7 RS485.8 | R6.1 1.59,24.73 4.35,21.96 4.35,21.58 6.1,19.82 13.01,19.82
VIN
  Top 0.508: 46.99,12.2 44.44,9.65 43.15,9.65 39.91,12.89 10.6,12.89 10.4,13.1 8,13.1 | 8,13.1 5.36,15.74 5.36,21.93 J2.1-3 | 8,13.1 6.45,11.54 J2.2-7 5.36,11.01 | 5.36,11.01 5.36,8.1 J2.2-3 | X4.1 5.11,11.26 5.36,11.01 | 46.99,12.2 F2.2 | U$3.TIP 46.99,12.2
  Bottom 0.508: J2.1-3 5.37,24.09 5.37,25.93 J2.1-7

### Text on the board
tPlace: VCC | UREG | A0 | SCK | MOSI | A3 | A5 | D5 | D2 | RST | TX | A1 | SS | MISO | A2 | A4 | D6 | D3 | A7 | RX | GND | GND | V2 | V2 | VCC | GND | VCC | GND | GND
bPlace: UREG | easyMySens-Gateway-Mini-RS485 V4.1
tNames: SDA | SCL | - | VCC | IN | VCC | VCC | SDA | SCL | SDA | SCL | VCC
bNames: VCC | Serial | - | IN | R3 | R2 | C6 | Bus Pull | VCC | R14 | + | C10 | 120 | R2 | - | R1 | R12 | R13 | R10 | C4 | R11 | R4 | R9 | Fuse
tValues: Gehäuse: RND 455‑00307